# Altium project 1166V30.PrjPCB (part 1 of 2)
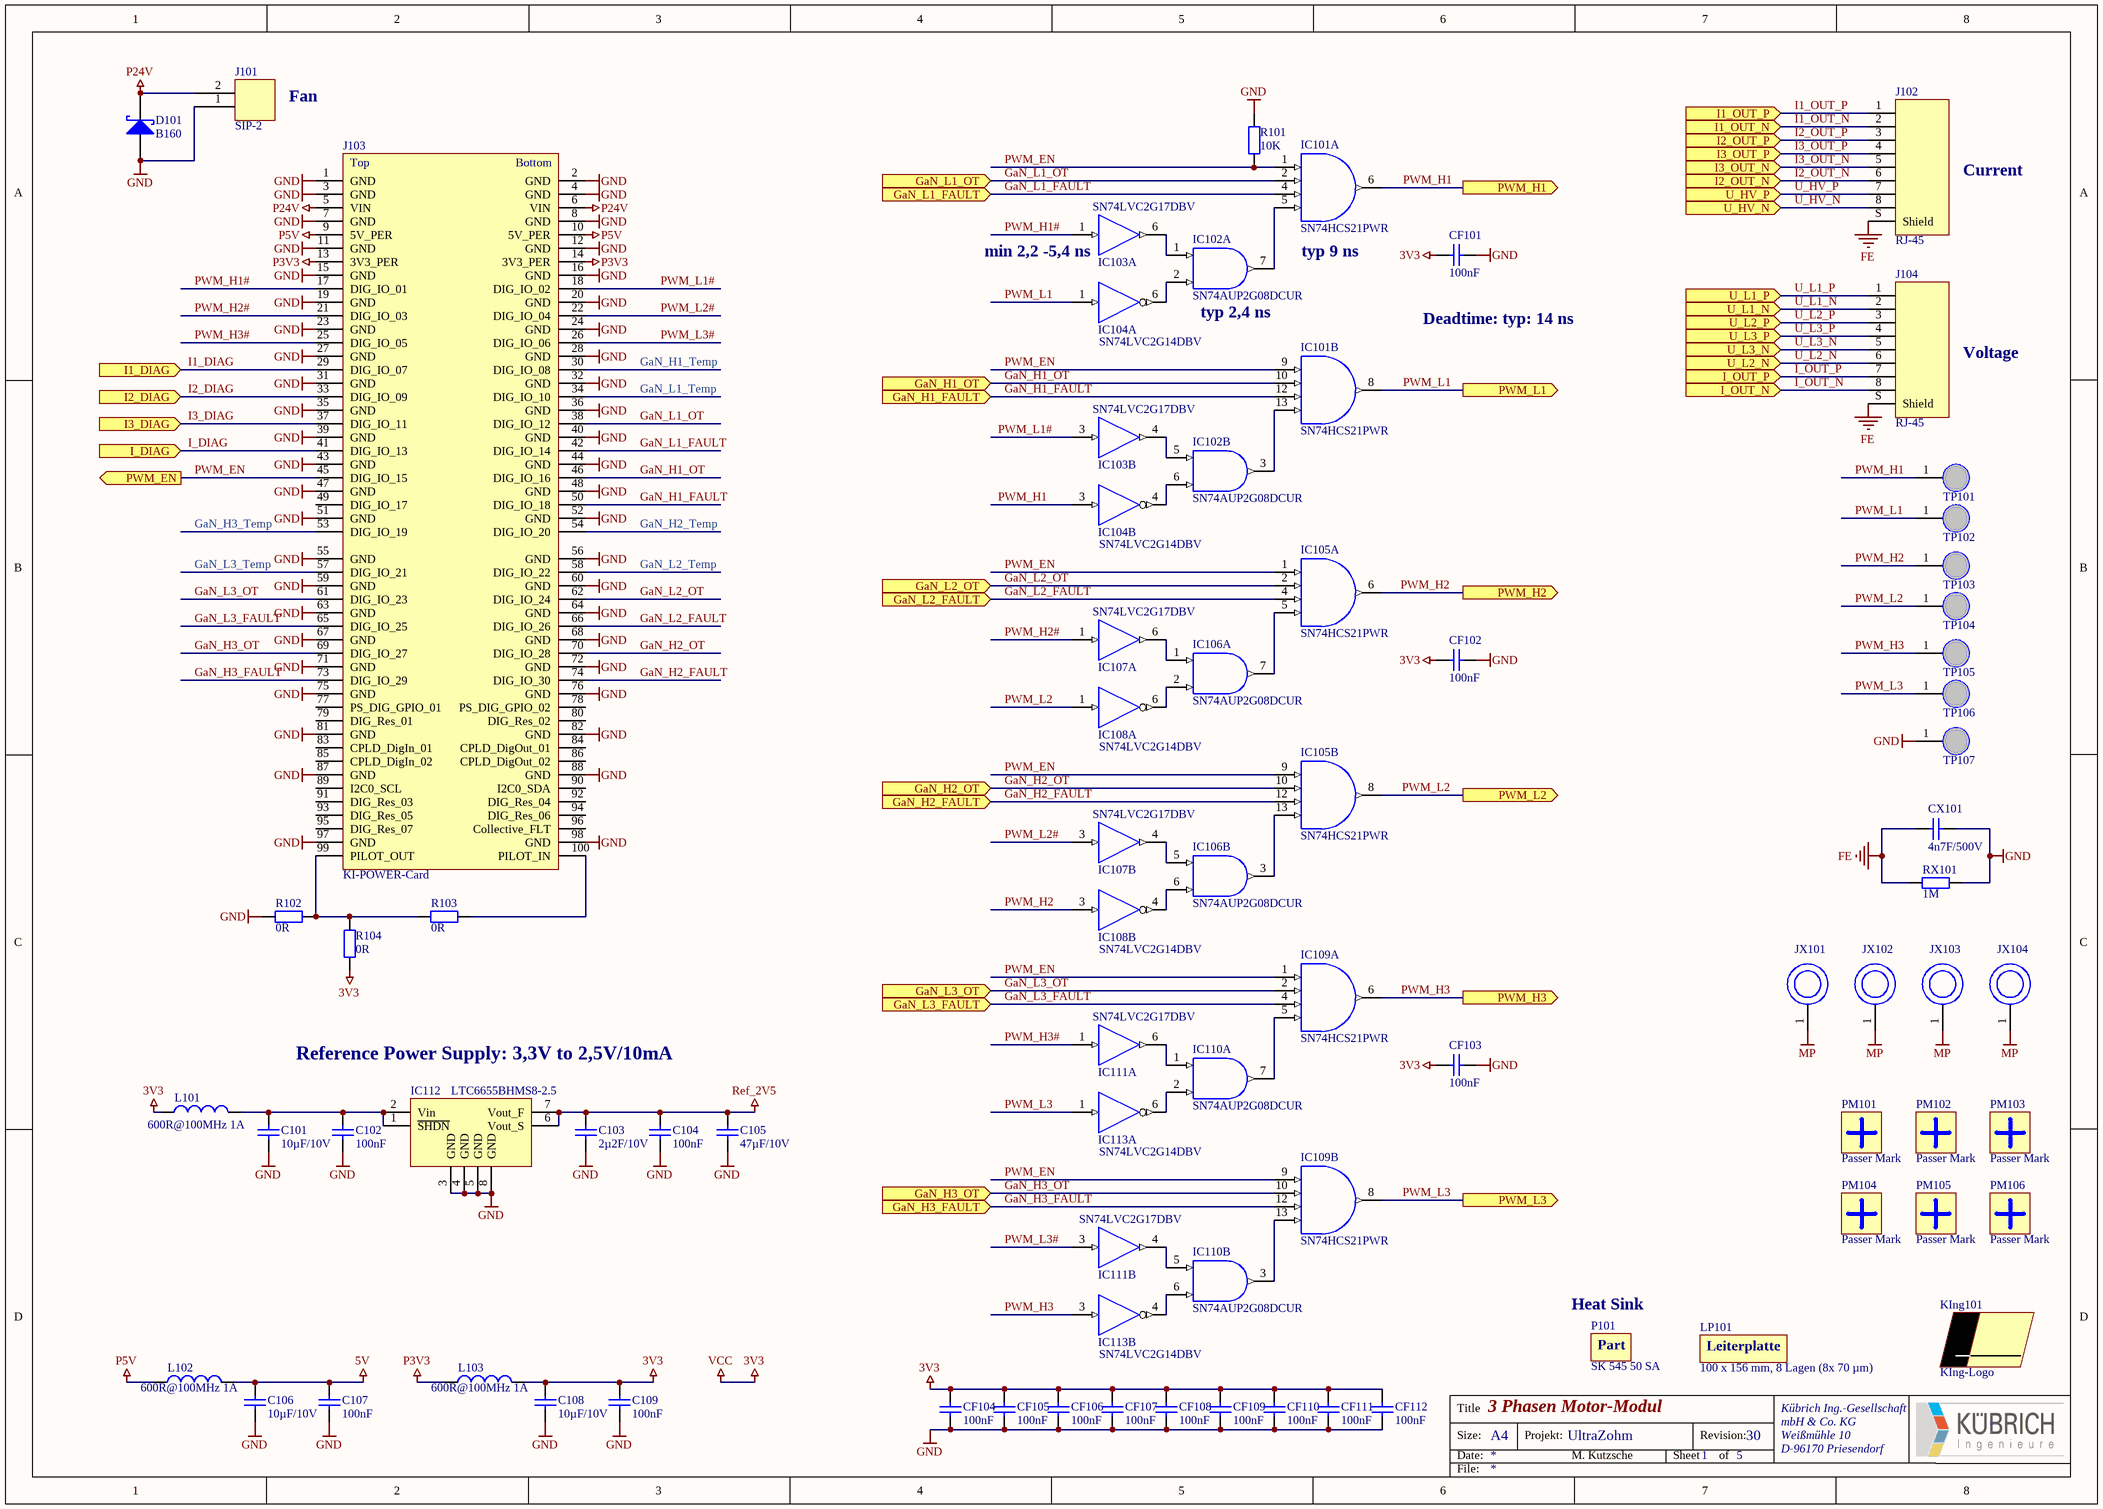
[diagram p0: 1166V30-1.SchDoc]
5 sheets, 581 parts. Net scope: flat (ports and power ports of the same name join across sheets).
Board file: 1166V30.PcbDoc
Sheets:
  1166V30-1.SchDoc
  1166V30-2.SchDoc
  1166V30-3.SchDoc
  1166V30-4.SchDoc
  1166V30-5.SchDoc

## Sheet 1166V30-1.SchDoc: 3 Phasen Motor-Modul
size A3; Author: M. Kutzsche; Organization: Kübrich Ing.-Gesellschaft; Address1: mbH & Co. KG; Address2: Weißmühle 10; Address3: D-96170 Priesendorf; DocumentNumber: UltraZohm; Revision: 30; SheetNumber: 1; SheetTotal: 5

### Parts
C101  10µF/10V  [0805-Cap]
C102  100nF  [0603-Cap]
C103  2µ2F/10V  [0805-Cap]
C104  100nF  [0603-Cap]
C105  47µF/10V  [1210-Cap]
C106  10µF/10V  [0603-Cap]
C107  100nF  [0603-Cap]
C108  10µF/10V  [0603-Cap]
C109  100nF  [0603-Cap]
CF101  100nF  [0603-Cap]
CF102  100nF  [0603-Cap]
CF103  100nF  [0603-Cap]
CF104  100nF  [0603-Cap]
CF105  100nF  [0603-Cap]
CF106  100nF  [0603-Cap]
CF107  100nF  [0603-Cap]
CF108  100nF  [0603-Cap]
CF109  100nF  [0603-Cap]
CF110  100nF  [0603-Cap]
CF111  100nF  [0603-Cap]
CF112  100nF  [0603-Cap]
CX101  4n7F/500V  [1206-Cap]
D101  B160  [SMA]
IC101  SN74HCS21PWR  [TSSOP-14]  (parts A,B of 2)
IC102  SN74AUP2G08DCUR  [VSSOP-8]  (parts A,B of 2)
IC103  SN74LVC2G17DBV  [SOT-23-6]  (parts A,B of 2)
IC104  SN74LVC2G14DBV  [SOT-23-6]  (parts A,B of 2)
IC105  SN74HCS21PWR  [TSSOP-14]  (parts A,B of 2)
IC106  SN74AUP2G08DCUR  [VSSOP-8]  (parts A,B of 2)
IC107  SN74LVC2G17DBV  [SOT-23-6]  (parts A,B of 2)
IC108  SN74LVC2G14DBV  [SOT-23-6]  (parts A,B of 2)
IC109  SN74HCS21PWR  [TSSOP-14]  (parts A,B of 2)
IC110  SN74AUP2G08DCUR  [VSSOP-8]  (parts A,B of 2)
IC111  SN74LVC2G17DBV  [SOT-23-6]  (parts A,B of 2)
IC112  LTC6655BHMS8-2.5  [MSOP-8 (RM-8)]
IC113  SN74LVC2G14DBV  [SOT-23-6]  (parts A,B of 2)
J101  SIP-2  [SIP-2]
J102  RJ-45  [WE-634008149821]
J103  KI-POWER-Card  [KI-POWER-CARD]
J104  RJ-45  [WE-634008149821]
JX101  Drill PAD  [PAD-6.0/3.2]  (value not drawn)  (no BOM)
JX102  Drill PAD  [PAD-6.0/3.2]  (value not drawn)  (no BOM)
JX103  Drill PAD  [PAD-6.0/3.2]  (value not drawn)  (no BOM)
JX104  Drill PAD  [PAD-6.0/3.2]  (value not drawn)  (no BOM)
KIng101  KIng-Logo  [King_Logo 900x300mil short]  (no BOM)
L101  600R@100MHz 1A  [0603-Ind]
L102  600R@100MHz 1A  [0603-Ind]
L103  600R@100MHz 1A  [0603-Ind]
LP101  100 x 156 mm, 8 Lagen (8x 70 µm)  [LP]
P101  SK 545 50 SA  [Part]
PM101  Passer Mark  [PASSER-MARK Rund 1,2mm]
PM102  Passer Mark  [PASSER-MARK Rund 1,2mm]
PM103  Passer Mark  [PASSER-MARK Rund 1,2mm]
PM104  Passer Mark  [PASSER-MARK Rund 1,2mm]
PM105  Passer Mark  [PASSER-MARK Rund 1,2mm]
PM106  Passer Mark  [PASSER-MARK Rund 1,2mm]
R101  10K  [0603-Res]
R102  0R  [0603-Res]
R103  0R  [0603-Res]
R104  0R  [0603-Res]
RX101  1M  [1206-Res]
TP101  Test-Point  [PAD-1.0/1.8]  (value not drawn)  (no BOM)
TP102  Test-Point  [PAD-1.0/1.8]  (value not drawn)  (no BOM)
TP103  Test-Point  [PAD-1.0/1.8]  (value not drawn)  (no BOM)
TP104  Test-Point  [PAD-1.0/1.8]  (value not drawn)  (no BOM)
TP105  Test-Point  [PAD-1.0/1.8]  (value not drawn)  (no BOM)
TP106  Test-Point  [PAD-1.0/1.8]  (value not drawn)  (no BOM)
TP107  Test-Point  [PAD-1.0/1.8]  (value not drawn)  (no BOM)

### Ports
GaN_H1_FAULT (in), GaN_H1_OT (in), GaN_H2_FAULT (in), GaN_H2_OT (in), GaN_H3_FAULT (in), GaN_H3_OT (in), GaN_L1_FAULT (in), GaN_L1_OT (in), GaN_L2_FAULT (in), GaN_L2_OT (in), GaN_L3_FAULT (in), GaN_L3_OT (in), I1_DIAG (in), I1_OUT_N (in), I1_OUT_P (in), I2_DIAG (in), I2_OUT_N (in), I2_OUT_P (in), I3_DIAG (in), I3_OUT_N (in), I3_OUT_P (in), I_DIAG (in), I_OUT_N (in), I_OUT_P (in), PWM_EN (out), PWM_H1 (out), PWM_H2 (out), PWM_H3 (out), PWM_L1 (out), PWM_L2 (out), PWM_L3 (out), U_HV_N (in), U_HV_P (in), U_L1_N (in), U_L1_P (in), U_L2_N (in), U_L2_P (in), U_L3_N (in), U_L3_P (in)

### Nets
3V3: C108.2 C109.2 CF101.2 CF102.2 CF103.2 CF104.1 CF105.1 CF106.1 CF107.1 CF108.1 CF109.1 CF110.1 CF111.1 CF112.1 IC101.14(VCC) IC102.8(VCC) IC103.5(VCC) IC104.5(VCC) IC105.14(VCC) IC106.8(VCC) IC107.5(VCC) IC108.5(VCC) IC109.14(VCC) IC110.8(VCC) IC111.5(VCC) IC113.5(VCC) L101.1 L103.2 R104.1  [also labelled VCC]
5V: C106.2 C107.2 L102.2
FE: CX101.1 J102.S(Shield) J104.S(Shield) RX101.1
GND: C101.1 C102.1 C103.1 C104.1 C105.1 C106.1 C107.1 C108.1 C109.1 CF101.1 CF102.1 CF103.1 CF104.2 CF105.2 CF106.2 CF107.2 CF108.2 CF109.2 CF110.2 CF111.2 CF112.2 CX101.2 D101.1(A) IC101.7(GND) IC102.4(GND) IC103.2(GND) IC104.2(GND) IC105.7(GND) IC106.4(GND) IC107.2(GND) IC108.2(GND) IC109.7(GND) IC110.4(GND) IC111.2(GND) IC112.3(GND) IC112.4(GND) IC112.5(GND) IC112.8(GND) IC113.2(GND) J101.1 J103.1(GND) J103.2(GND) J103.3(GND) J103.4(GND) J103.7(GND) J103.8(GND) J103.11(GND) J103.12(GND) J103.15(GND) J103.16(GND) J103.19(GND) J103.20(GND) J103.23(GND) J103.24(GND) J103.27(GND) J103.28(GND) J103.31(GND) J103.32(GND) J103.35(GND) J103.36(GND) J103.39(GND) J103.40(GND) J103.43(GND) J103.44(GND) J103.47(GND) J103.48(GND) J103.51(GND) J103.52(GND) J103.55(GND) J103.56(GND) J103.59(GND) J103.60(GND) J103.63(GND) J103.64(GND) J103.67(GND) J103.68(GND) J103.71(GND) J103.72(GND) J103.75(GND) J103.76(GND) J103.81(GND) J103.82(GND) J103.87(GND) J103.88(GND) J103.97(GND) J103.98(GND) R101.2 R102.1 RX101.2 TP107.1
MP: JX101.1 JX102.1 JX103.1 JX104.1
P3V3: J103.13(3V3_PER) J103.14(3V3_PER) L103.1
P5V: J103.9(5V_PER) J103.10(5V_PER) L102.1
P24V: D101.2(K) J101.2 J103.5(VIN) J103.6(VIN)
Ref_2V5: C103.2 C104.2 C105.2 IC112.6(Vout_S) IC112.7(Vout_F)
GaN_H1_FAULT: IC101.12(C2) J103.50(DIG_IO_18) ; port GaN_H1_FAULT
GaN_H1_OT: IC101.10(B2) J103.46(DIG_IO_16) ; port GaN_H1_OT
GaN_H1_Temp: J103.30(DIG_IO_08)
GaN_H2_FAULT: IC105.12(C2) J103.74(DIG_IO_30) ; port GaN_H2_FAULT
GaN_H2_OT: IC105.10(B2) J103.70(DIG_IO_28) ; port GaN_H2_OT
GaN_H2_Temp: J103.54(DIG_IO_20)
GaN_H3_FAULT: IC109.12(C2) J103.73(DIG_IO_29) ; port GaN_H3_FAULT
GaN_H3_OT: IC109.10(B2) J103.69(DIG_IO_27) ; port GaN_H3_OT
GaN_H3_Temp: J103.53(DIG_IO_19)
GaN_L1_FAULT: IC101.4(C1) J103.42(DIG_IO_14) ; port GaN_L1_FAULT
GaN_L1_OT: IC101.2(B1) J103.38(DIG_IO_12) ; port GaN_L1_OT
GaN_L1_Temp: J103.34(DIG_IO_10)
GaN_L2_FAULT: IC105.4(C1) J103.66(DIG_IO_26) ; port GaN_L2_FAULT
GaN_L2_OT: IC105.2(B1) J103.62(DIG_IO_24) ; port GaN_L2_OT
GaN_L2_Temp: J103.58(DIG_IO_22)
GaN_L3_FAULT: IC109.4(C1) J103.65(DIG_IO_25) ; port GaN_L3_FAULT
GaN_L3_OT: IC109.2(B1) J103.61(DIG_IO_23) ; port GaN_L3_OT
GaN_L3_Temp: J103.57(DIG_IO_21)
I1_DIAG: J103.29(DIG_IO_07) ; port I1_DIAG
I1_OUT_N: J102.2 ; port I1_OUT_N
I1_OUT_P: J102.1 ; port I1_OUT_P
I2_DIAG: J103.33(DIG_IO_09) ; port I2_DIAG
I2_OUT_N: J102.6 ; port I2_OUT_N
I2_OUT_P: J102.3 ; port I2_OUT_P
I3_DIAG: J103.37(DIG_IO_11) ; port I3_DIAG
I3_OUT_N: J102.5 ; port I3_OUT_N
I3_OUT_P: J102.4 ; port I3_OUT_P
I_DIAG: J103.41(DIG_IO_13) ; port I_DIAG
I_OUT_N: J104.8 ; port I_OUT_N
I_OUT_P: J104.7 ; port I_OUT_P
PWM_EN: IC101.1(A1) IC101.9(A2) IC105.1(A1) IC105.9(A2) IC109.1(A1) IC109.9(A2) J103.45(DIG_IO_15) R101.1 ; port PWM_EN
PWM_H1: IC101.6(O1) IC104.3(2A) TP101.1 ; port PWM_H1
PWM_H1#: IC103.1(1A) J103.17(DIG_IO_01)
PWM_H2: IC105.6(O1) IC108.3(2A) TP103.1 ; port PWM_H2
PWM_H2#: IC107.1(1A) J103.21(DIG_IO_03)
PWM_H3: IC109.6(O1) IC113.3(2A) TP105.1 ; port PWM_H3
PWM_H3#: IC111.1(1A) J103.25(DIG_IO_05)
PWM_L1: IC101.8(O2) IC104.1(1A) TP102.1 ; port PWM_L1
PWM_L1#: IC103.3(2A) J103.18(DIG_IO_02)
PWM_L2: IC105.8(O2) IC108.1(1A) TP104.1 ; port PWM_L2
PWM_L2#: IC107.3(2A) J103.22(DIG_IO_04)
PWM_L3: IC109.8(O2) IC113.1(1A) TP106.1 ; port PWM_L3
PWM_L3#: IC111.3(2A) J103.26(DIG_IO_06)
U_HV_N: J102.8 ; port U_HV_N
U_HV_P: J102.7 ; port U_HV_P
U_L1_N: J104.2 ; port U_L1_N
U_L1_P: J104.1 ; port U_L1_P
U_L2_N: J104.6 ; port U_L2_N
U_L2_P: J104.3 ; port U_L2_P
U_L3_N: J104.5 ; port U_L3_N
U_L3_P: J104.4 ; port U_L3_P
NetC101_2: C101.2 C102.2 IC112.1(~{SHDN}) IC112.2(Vin) L101.2
NetIC101_5: IC101.5(D1) IC102.7(1Y)
NetIC101_13: IC101.13(D2) IC102.3(2Y)
NetIC102_1: IC102.1(1A) IC103.6(1Y)
NetIC102_2: IC102.2(1B) IC104.6(1Y)
NetIC102_5: IC102.5(2A) IC103.4(2Y)
NetIC102_6: IC102.6(2B) IC104.4(2Y)
NetIC105_5: IC105.5(D1) IC106.7(1Y)
NetIC105_13: IC105.13(D2) IC106.3(2Y)
NetIC106_1: IC106.1(1A) IC107.6(1Y)
NetIC106_2: IC106.2(1B) IC108.6(1Y)
NetIC106_5: IC106.5(2A) IC107.4(2Y)
NetIC106_6: IC106.6(2B) IC108.4(2Y)
NetIC109_5: IC109.5(D1) IC110.7(1Y)
NetIC109_13: IC109.13(D2) IC110.3(2Y)
NetIC110_1: IC110.1(1A) IC111.6(1Y)
NetIC110_2: IC110.2(1B) IC113.6(1Y)
NetIC110_5: IC110.5(2A) IC111.4(2Y)
NetIC110_6: IC110.6(2B) IC113.4(2Y)
NetJ103_99: J103.99(PILOT_OUT) R102.2 R103.1 R104.2
NetJ103_100: J103.100(PILOT_IN) R103.2

Not connected (* = marked no-connect by the designer): J103 49(DIG_IO_17) 77(PS_DIG_GPIO_01) 78(PS_DIG_GPIO_02) 79(DIG_Res_01) 80(DIG_Res_02) 83(CPLD_DigIn_01) 84(CPLD_DigOut_01) 85(CPLD_DigIn_02) 86(CPLD_DigOut_02) 89(I2C0_SCL) 90(I2C0_SDA) 91(DIG_Res_03) 92(DIG_Res_04) 93(DIG_Res_05) 94(DIG_Res_06) 95(DIG_Res_07) 96(Collective_FLT)

### Notes on the sheet
- Fan
- Current
- (near IC103) min 2,2 -5,4 ns
- (near IC102) typ 2,4 ns
- typ 9 ns
- Deadtime: typ: 14 ns
- Voltage
- Reference Power Supply: 3,3V to 2,5V/10mA
- Heat Sink
- Title
- Size:
- Date:
- A4
- Projekt:
- Sheet
- Revision:
- of
- File:
- (in symbol KI-POWER-Card) Top; Bottom

### Library data of the parts
C101-C109 CF101-CF112 CX101 = Cap_SMD: Capacitor (SMD); Class I: Pasiv; Class II: Capacitor; Last edited: 20.11.2006 10:25
  C101 C106 C108: value: 10µF/10V
  C102 C104 C107 C109 CF101-CF112: value: 100nF
  C103: value: 2µ2F/10V
  C105: value: 47µF/10V
  CX101: value: 4n7F/500V
D101 = B160: Schottky Barrier Rectifier Vr=60V If=1A; Manufacturer: General Semiconductor; Class II: Schottky Earrier Rectifier Vr=60V If=1A; Class I: Discret; Package information: Unknown; Best.-Nr.: Farnell 145-6528RL; Datasheet: Ver. 7 Nov 2000; Package reference: DO-214AC (SMA)
IC101 IC105 IC109 = SN74HCS21PWR: Dual 4-Input AND Gate with Schmitt Trigger Input; Manufacturer: Texas Instrument; Package Information: Unknown; Class I: Logic; Best.-Nr.: DigiKey: 296-SN74HCS21PWRCT-ND; Datasheet: SCES200J; Package Reference: TSSOP-14; Class II: Gate
IC102 IC106 IC110 = SN74AUP2G08DCUR: (VSSOP) Dual 2-Input Positive AND Gate; Manufacturer: Texas Instrument; Package Information: Unknown; Class I: Logic; Datasheet: SCES193J, Rev. Sep 2003; Package Reference: VSSOP-8; Class II: Dual 2-Input Positive AND Gate
IC103 IC107 IC111 = SN74LVC2G17D_: Dual Buffer with Schmitt Trigger Input; Manufacturer: Texas Instrument; Class I: Logic; value121: SN74LVC2G17DCK; Best.-Nr.: Farnell 147-0776 (SOT23-6), 128-7569 (SC-70); Datasheet: SCES381E, Rev. Sep 2003; Class II: Dual Buffer with Schmitt Trigger Input; value111: SN74LVC2G17DBV; Last edited: 22.01.2007 11:08
IC104 IC108 IC113 = SN74LVC2G14D_: Dual Inverter with Schmitt Trigger Input; Manufacturer: Texas Instrument; Class I: Logic; value121: SN74LVC2G14DCK; Datasheet: SCES200J; Class II: Dual Inverter with Schmitt Trigger Input; value111: SN74LVC2G14DBV; Last edited: 22.01.2007 11:08
IC112 = LTC6655BHMS8-2.5: Voltage References 2,5V, 2ppm/°C, Low Noise 0,25ppm; Manufacturer: Linear Technology; Class I: Discret; Package information: Unknown; Best.-Nr.: Farnell 229-5508; Class II: Voltage References 2,5V, 2ppm/°C, Low Noise 0,25ppm; Datasheet: Unknown; Package reference: MSOP-8
J101 = SIP-2: Single In-line Connector 2 pin; Class I: Connectors; Class II: Single In-line Connector 2 pin; Last edited: 08.12.2006 17:09
J102 J104 = WE-634008149821: SMD CAT3 RJ-45 Connector; Manufacturer: Würth Elektronik; Class I: Connectors; Class II: RJ-45 Connector; Package reference: WE-634008149821; Datasheet: Unknown; Best.-Nr.: WE-634008149821
J103 = KI-POWER-Card: Einsteckkarte für KI-POWER Projekt (Ultra ZYNQ); Manufacturer: Samtec; Class I: Connectors; Best.-Nr.: Gegenstecker: Samtec HSEC8-150-01-XX-DV-A-BL; Class II: Einsteckkarte für KI-POWER Projekt (Ultra ZYNQ); Datasheet: 2000/1; Last edited: 07.09.2020 13:28
JX101-JX104 = Drill PAD: PAD
KIng101 = KIng-Logo: Kuebrich-Ing. Logo
L101-L103 = WE-742792651: Ferrite SMD 600R@100MHz 1A (0603); Manufacturer: Wuerth-Elektronik; Class I: Pasive; Class II: Ferrite SMD 600R@100MHz 1A; Last edited: 08.12.2006 12:28; Best.-Nr.: WE-742792651
LP101 = Leiterplatte: Leiterplatte 100 x 156 mm, 8 Lagen (8x 70 µm); Manufacturer: Generic Manufacturer; Footprint: Größe 100 x 156 mm
P101 = Part: Kühlkörper 80x50x10 mm; Manufacturer: Fischer Elektronik; Best.-Nr.: SK 545 50 SA
R101-R104 RX101 = Res_SMD: Resistor SMD; Class I: Pasiv; Class II: Resistor; Last edited: 17.11.2006 11:38
  R101: value: 10K
  R102-R104: value: 0R
  RX101: value: 1M
TP101-TP107 = Test-Point: PAD

## Sheet 1166V30-2.SchDoc: Half-Bridge Phase 1
size A3; Author: M. Kutzsche; Organization: Kübrich Ing.-Gesellschaft; Address1: mbH & Co. KG; Address2: Weißmühle 10; Address3: D-96170 Priesendorf; DocumentNumber: UltraZohm; Revision: 30; SheetNumber: 2; SheetTotal: 5
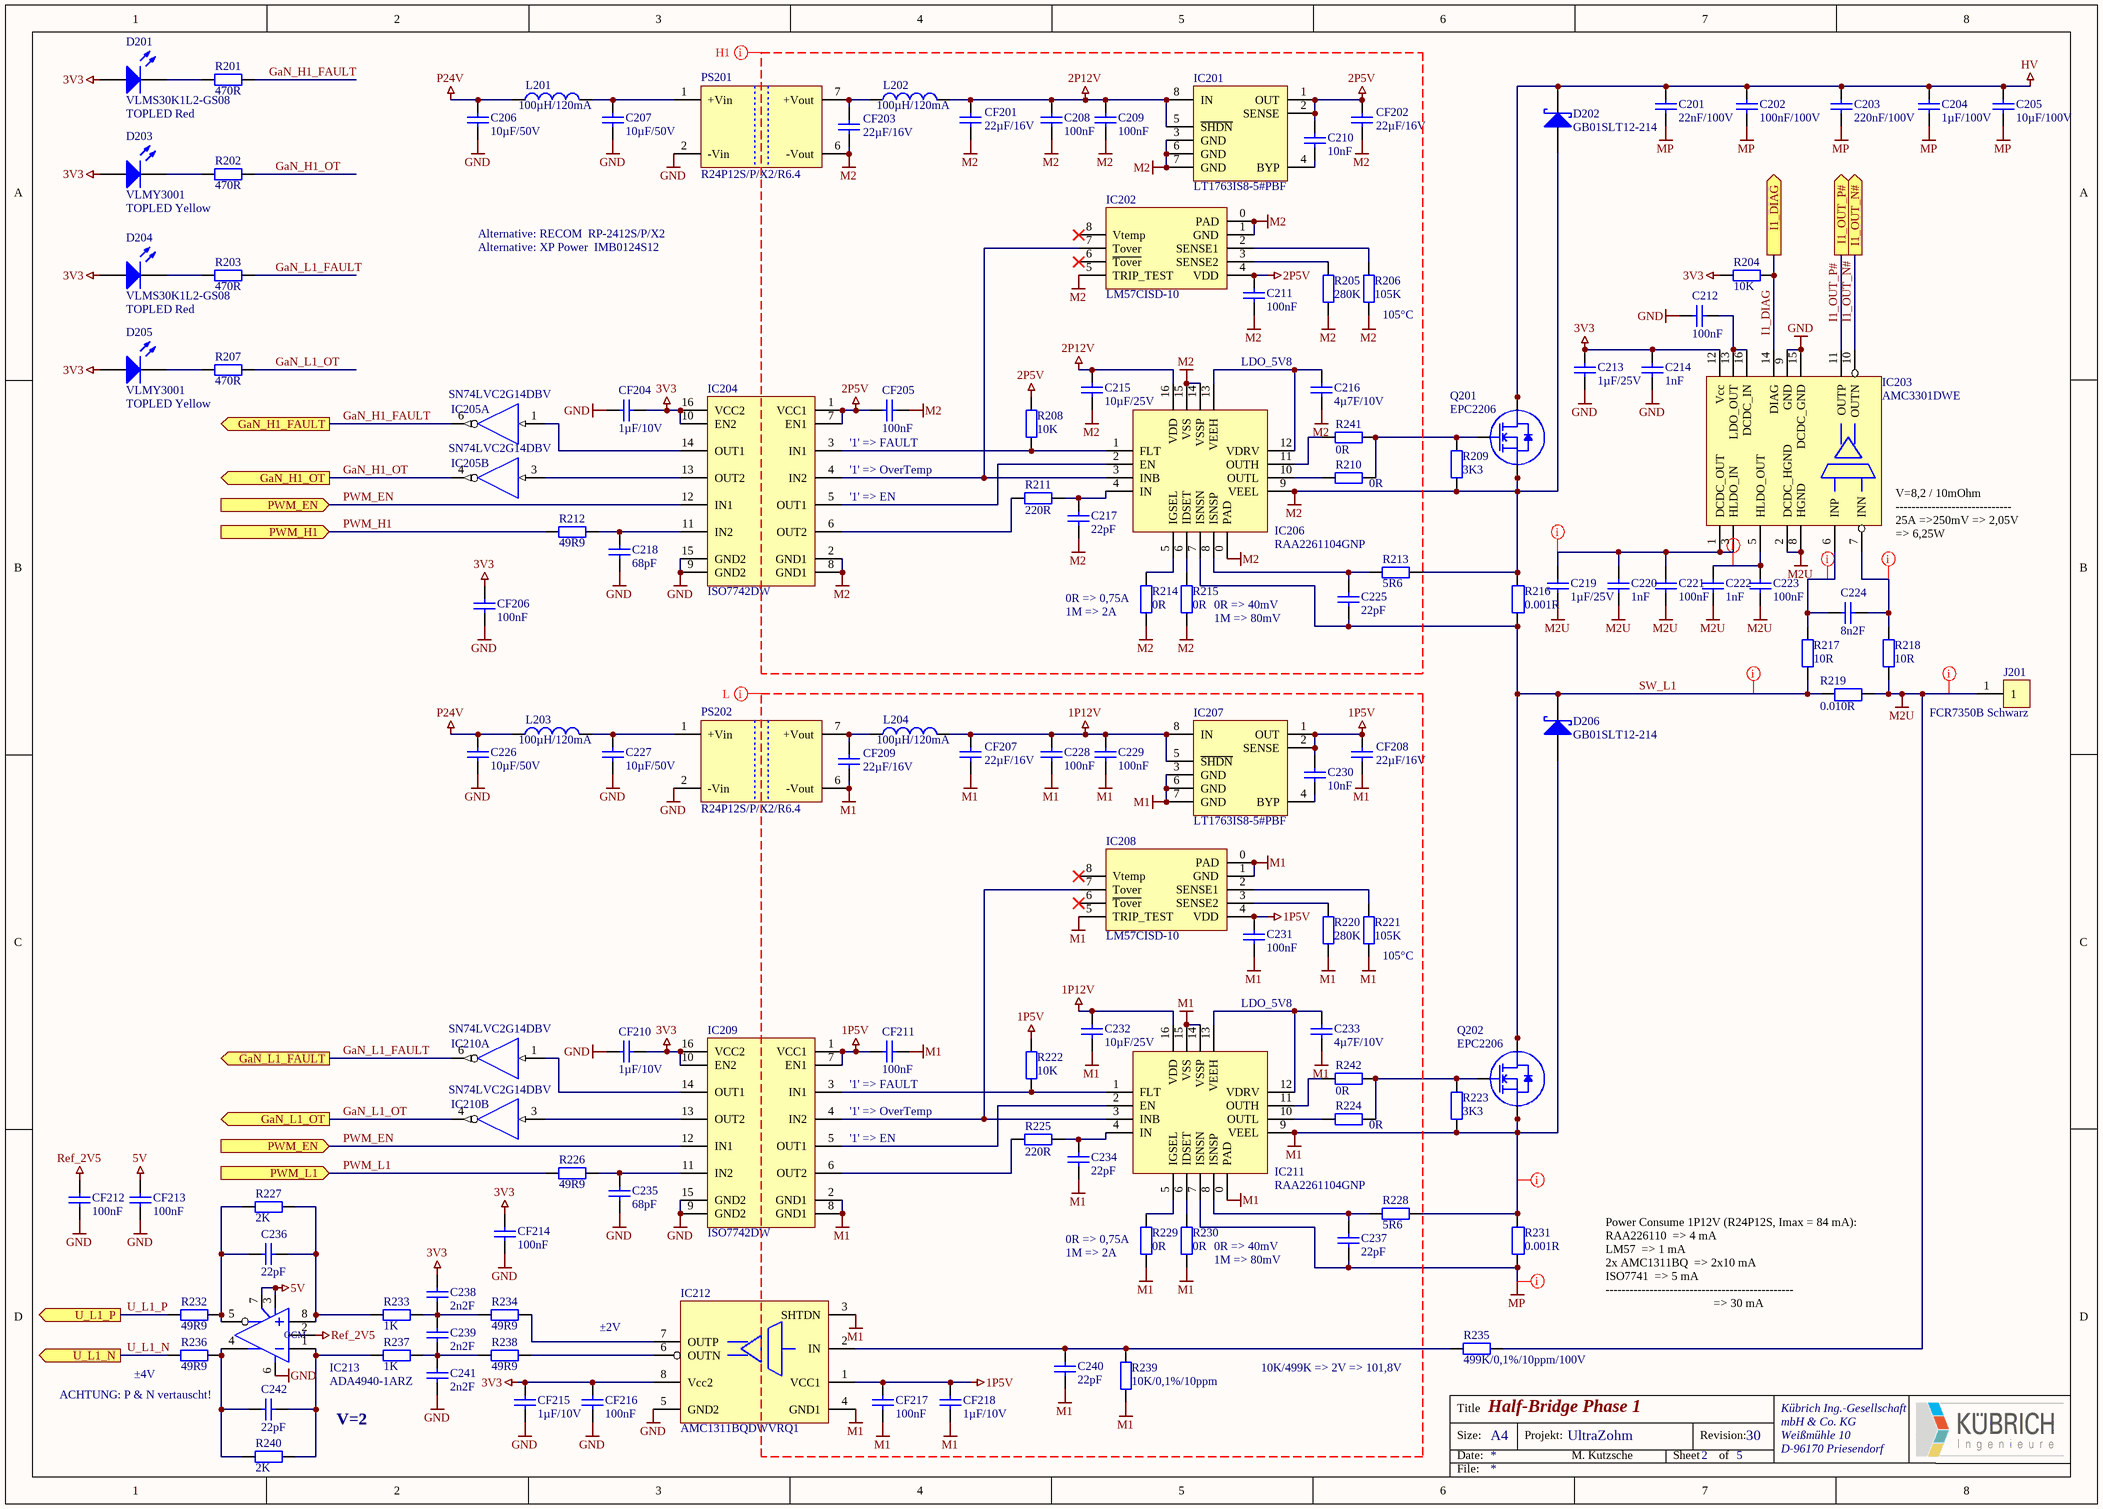
[diagram p1: 1166V30-2.SchDoc]

### Parts
C201  22nF/100V  [0805-Cap]
C202  100nF/100V  [0805-Cap]
C203  220nF/100V  [0805-Cap]
C204  1µF/100V  [0805-Cap]
C205  10µF/100V  [1210-Cap]
C206  10µF/50V  [1206-Cap]
C207  10µF/50V  [1206-Cap]
C208  100nF  [0603-Cap]
C209  100nF  [0603-Cap]
C210  10nF  [0603-Cap]
C211  100nF  [0603-Cap]
C212  100nF  [0603-Cap]
C213  1µF/25V  [1206-Cap]
C214  1nF  [1206-Cap]
C215  10µF/25V  [0805-Cap]
C216  4µ7F/10V  [0805-Cap]
C217  22pF  [0603-Cap]
C218  68pF  [0603-Cap]
C219  1µF/25V  [0603-Cap]
C220  1nF  [0603-Cap]
C221  100nF  [0603-Cap]
C222  1nF  [1206-Cap]
C223  100nF  [1206-Cap]
C224  8n2F  [0603-Cap]
C225  22pF  [0603-Cap]
C226  10µF/50V  [1206-Cap]
C227  10µF/50V  [1206-Cap]
C228  100nF  [0603-Cap]
C229  100nF  [0603-Cap]
C230  10nF  [0603-Cap]
C231  100nF  [0603-Cap]
C232  10µF/25V  [0805-Cap]
C233  4µ7F/10V  [0805-Cap]
C234  22pF  [0603-Cap]
C235  68pF  [0603-Cap]
C236  22pF  [0603-Cap]
C237  22pF  [0603-Cap]
C238  2n2F  [0603-Cap]
C239  2n2F  [0603-Cap]
C240  22pF  [0603-Cap]
C241  2n2F  [0603-Cap]
C242  22pF  [0603-Cap]
CF201  22µF/16V  [0805-Cap]
CF202  22µF/16V  [0805-Cap]
CF203  22µF/16V  [0805-Cap]
CF204  1µF/10V  [0603-Cap]
CF205  100nF  [0603-Cap]
CF206  100nF  [0603-Cap]
CF207  22µF/16V  [0805-Cap]
CF208  22µF/16V  [0805-Cap]
CF209  22µF/16V  [0805-Cap]
CF210  1µF/10V  [0603-Cap]
CF211  100nF  [0603-Cap]
CF212  100nF  [0603-Cap]
CF213  100nF  [0603-Cap]
CF214  100nF  [0603-Cap]
CF215  1µF/10V  [0603-Cap]
CF216  100nF  [0603-Cap]
CF217  100nF  [0603-Cap]
CF218  1µF/10V  [0603-Cap]
D201  VLMS30K1L2-GS08  Class II: TOPLED Red  [PLCC-2_rot]
D202  GB01SLT12-214  [DO-214 (SMB)]
D203  VLMY3001  Class II: TOPLED Yellow  [PLCC-2_gelb]
D204  VLMS30K1L2-GS08  Class II: TOPLED Red  [PLCC-2_rot]
D205  VLMY3001  Class II: TOPLED Yellow  [PLCC-2_gelb]
D206  GB01SLT12-214  [DO-214 (SMB)]
IC201  LT1763IS8-5#PBF  [SOIC-8-N]
IC202  LM57CISD-10  [WSON-8 (2.5x2.5mm)]
IC203  AMC3301DWE  [SOIC-16-W - 8.1mm]
IC204  ISO7742DW  [SOIC-16-W - 8.1mm]
IC205  SN74LVC2G14DBV  [SOT-23-6]  (parts A,B of 2)
IC206  RAA2261104GNP  [QFN-16 (4x4mm)]
IC207  LT1763IS8-5#PBF  [SOIC-8-N]
IC208  LM57CISD-10  [WSON-8 (2.5x2.5mm)]
IC209  ISO7742DW  [SOIC-16-W - 8.1mm]
IC210  SN74LVC2G14DBV  [SOT-23-6]  (parts A,B of 2)
IC211  RAA2261104GNP  [QFN-16 (4x4mm)]
IC212  AMC1311BQDWVRQ1  [SOIC-8-W]
IC213  ADA4940-1ARZ  [SOIC-8-N]
J201  FCR7350B Schwarz  [SLB4-I/90 - 4mm - Schwarz - CLIFF]
L201  100µH/120mA  [1007-IND (2518)]
L202  100µH/120mA  [1007-IND (2518)]
L203  100µH/120mA  [1007-IND (2518)]
L204  100µH/120mA  [1007-IND (2518)]
PS201  R24P12S/P/X2/R6.4  [SIP-7 Single - X2]
PS202  R24P12S/P/X2/R6.4  [SIP-7 Single - X2]
Q201  EPC2206  [D0232]
Q202  EPC2206  [D0232]
R201  470R  [0603-Res]
R202  470R  [0603-Res]
R203  470R  [0603-Res]
R204  10K  [0603-Res]
R205  280K  [0603-Res]
R206  105K  [0603-Res]
R207  470R  [0603-Res]
R208  10K  [0603-Res]
R209  3K3  [0603-Res]
R210  0R  [0603-Res]
R211  220R  [0603-Res]
R212  49R9  [0603-Res]
R213  5R6  [0603-Res]
R214  0R  [0603-Res]
R215  0R  [0603-Res]
R216  0.001R  [2512]
R217  10R  [0603-Res]
R218  10R  [0603-Res]
R219  0.010R  [GMR320]
R220  280K  [0603-Res]
R221  105K  [0603-Res]
R222  10K  [0603-Res]
R223  3K3  [0603-Res]
R224  0R  [0603-Res]
R225  220R  [0603-Res]
R226  49R9  [0603-Res]
R227  2K  [0603-Res]
R228  5R6  [0603-Res]
R229  0R  [0603-Res]
R230  0R  [0603-Res]
R231  0.001R  [2512]
R232  49R9  [0603-Res]
R233  1K  [0603-Res]
R234  49R9  [0603-Res]
R235  499K/0,1%/10ppm/100V  [0805-Res]
R236  49R9  [0603-Res]
R237  1K  [0603-Res]
R238  49R9  [0603-Res]
R239  10K/0,1%/10ppm  [0603-Res]
R240  2K  [0603-Res]
R241  0R  [0603-Res]
R242  0R  [0603-Res]

### Ports
GaN_H1_FAULT (out), GaN_H1_OT (out), GaN_L1_FAULT (out), GaN_L1_OT (out), I1_DIAG (out), I1_OUT_N# (out), I1_OUT_P# (out), PWM_EN (in), PWM_H1 (in), PWM_L1 (in), U_L1_N (out), U_L1_P (out)

### Nets
1P5V: C230.1 C231.1 CF208.1 CF211.2 CF217.1 CF218.1 IC207.1(OUT) IC207.2(SENSE) IC208.4(VDD) IC209.1(VCC1) IC209.7(EN1) IC212.1(VCC1) R222.1
1P12V: C228.1 C229.1 C232.2 CF207.1 IC207.5(~{SHDN}) IC207.8(IN) IC211.16(VDD) L204.2
2P5V: C210.1 C211.1 CF202.1 CF205.2 IC201.1(OUT) IC201.2(SENSE) IC202.4(VDD) IC204.1(VCC1) IC204.7(EN1) R208.1
2P12V: C208.1 C209.1 C215.2 CF201.1 IC201.5(~{SHDN}) IC201.8(IN) IC206.16(VDD) L202.2
3V3: C213.1 C214.1 C238.2 CF204.1 CF206.1 CF210.1 CF214.1 CF215.1 CF216.1 D201.1(A) D203.1(A) D204.1(A) D205.1(A) IC203.12(Vcc) IC204.10(EN2) IC204.16(VCC2) IC205.5(VCC) IC209.10(EN2) IC209.16(VCC2) IC210.5(VCC) IC212.8(Vcc2) R204.2  [also labelled VCC]
5V: CF213.1 IC213.3(V+) IC213.7(EN)
GND: C206.1 C207.1 C212.1 C213.2 C214.2 C218.1 C226.1 C227.1 C235.1 C241.1 CF204.2 CF206.2 CF210.2 CF212.2 CF213.2 CF214.2 CF215.2 CF216.2 IC203.9(GND) IC203.15(DCDC_GND) IC204.9(GND2) IC204.15(GND2) IC205.2(GND) IC209.9(GND2) IC209.15(GND2) IC210.2(GND) IC212.5(GND2) IC213.6(V-) PS201.2(-Vin) PS202.2(-Vin)
HV: C201.1 C202.1 C203.1 C204.1 C205.1 D202.2(K) Q201.3(D1) Q201.4(D2) Q201.7(D3) Q201.8(D4) Q201.11(D5) Q201.12(D6) Q201.15(D7) Q201.16(D8) Q201.19(D9) Q201.20(D10) Q201.23(D11) Q201.24(D12) Q201.27(D13) Q201.28(D14)
M1: C228.2 C229.2 C231.2 C232.1 C233.2 C234.1 C240.1 CF207.2 CF208.2 CF209.2 CF211.1 CF217.2 CF218.2 D206.1(A) IC207.3(GND) IC207.6(GND) IC207.7(GND) IC208.0(PAD) IC208.1(GND) IC208.5(TRIP_TEST) IC209.2(GND1) IC209.8(GND1) IC211.0(PAD) IC211.9(VEEL) IC211.14(VSSP) IC211.15(VSS) IC212.3(SHTDN) IC212.4(GND1) PS202.6(-Vout) Q202.2(S1) Q202.5(S2) Q202.6(S3) Q202.9(S4) Q202.10(S5) Q202.13(S6) Q202.14(S7) Q202.17(S8) Q202.18(S9) Q202.21(S10) Q202.22(S11) Q202.25(S12) Q202.26(S13) Q202.29(S14) Q202.30(Sub) R220.2 R221.2 R223.1 R228.2 R229.2 R230.2 R231.2 R239.2
M2: C208.2 C209.2 C211.2 C215.1 C216.2 C217.1 CF201.2 CF202.2 CF203.2 CF205.1 D202.1(A) IC201.3(GND) IC201.6(GND) IC201.7(GND) IC202.0(PAD) IC202.1(GND) IC202.5(TRIP_TEST) IC204.2(GND1) IC204.8(GND1) IC206.0(PAD) IC206.9(VEEL) IC206.14(VSSP) IC206.15(VSS) PS201.6(-Vout) Q201.2(S1) Q201.5(S2) Q201.6(S3) Q201.9(S4) Q201.10(S5) Q201.13(S6) Q201.14(S7) Q201.17(S8) Q201.18(S9) Q201.21(S10) Q201.22(S11) Q201.25(S12) Q201.26(S13) Q201.29(S14) Q201.30(Sub) R205.2 R206.2 R209.1 R213.2 R214.2 R215.2 R216.2
M2U: C219.2 C220.2 C221.2 C222.2 C223.2 IC203.2(DCDC_HGND) IC203.8(HGND) J201.1 R218.1 R219.1 R235.2
MP: C201.2 C202.2 C203.2 C204.2 C205.2 C237.1 IC211.7(ISNSN) R231.1
P24V: C206.2 C226.2 L201.1 L203.1
Ref_2V5: CF212.1 IC213.2(OCM)
GaN_H1_FAULT: IC205.6(1Y) R201.2 ; port GaN_H1_FAULT
GaN_H1_OT: IC205.4(2Y) R202.2 ; port GaN_H1_OT
GaN_L1_FAULT: IC210.6(1Y) R203.2 ; port GaN_L1_FAULT
GaN_L1_OT: IC210.4(2Y) R207.2 ; port GaN_L1_OT
I1_DIAG: IC203.14(DIAG) R204.1 ; port I1_DIAG
I1_OUT_N#: IC203.10(OUTN) ; port I1_OUT_N#
I1_OUT_P#: IC203.11(OUTP) ; port I1_OUT_P#
PWM_EN: IC204.12(IN1) IC209.12(IN1) ; port PWM_EN
PWM_H1: R212.2 ; port PWM_H1
PWM_L1: R226.2 ; port PWM_L1
SW_L1: C225.1 D206.2(K) IC206.7(ISNSN) Q202.3(D1) Q202.4(D2) Q202.7(D3) Q202.8(D4) Q202.11(D5) Q202.12(D6) Q202.15(D7) Q202.16(D8) Q202.19(D9) Q202.20(D10) Q202.23(D11) Q202.24(D12) Q202.27(D13) Q202.28(D14) R216.1 R217.1 R219.2
U_L1_N: R236.2 ; port U_L1_N
U_L1_P: R232.2 ; port U_L1_P
NetC207_2: C207.2 L201.2 PS201.1(+Vin)
NetC210_2: C210.2 IC201.4(BYP)
NetC212_2: C212.2 IC203.13(LDO_OUT) IC203.16(DCDC_IN)
NetC216_1: C216.1 IC206.12(VDRV) IC206.13(VEEH)
NetC217_2: C217.2 IC206.4(IN) R211.1
NetC218_2: C218.2 IC204.11(IN2) R212.1
NetC219_1: C219.1 C220.1 C221.1 IC203.1(DCDC_OUT) IC203.3(HLDO_IN)
NetC222_1: C222.1 C223.1 IC203.5(HLDO_OUT)
NetC224_1: C224.1 IC203.7(INN) R218.2
NetC224_2: C224.2 IC203.6(INP) R217.2
NetC225_2: C225.2 IC206.8(ISNSP) R213.1
NetC227_2: C227.2 L203.2 PS202.1(+Vin)
NetC230_2: C230.2 IC207.4(BYP)
NetC233_1: C233.1 IC211.12(VDRV) IC211.13(VEEH)
NetC234_2: C234.2 IC211.4(IN) R225.1
NetC235_2: C235.2 IC209.11(IN2) R226.1
NetC236_1: C236.1 IC213.8(+) R227.1 R233.2
NetC236_2: C236.2 IC213.5(Out) R227.2 R232.1
NetC237_2: C237.2 IC211.8(ISNSP) R228.1
NetC238_1: C238.1 C239.2 R233.1 R234.2
NetC239_1: C239.1 C241.2 R237.1 R238.2
NetC240_2: C240.2 IC212.2(IN) R235.1 R239.1
NetC242_1: C242.1 IC213.1(-) R237.2 R240.1
NetC242_2: C242.2 IC213.4(Out) R236.1 R240.2
NetCF203_1: CF203.1 L202.1 PS201.7(+Vout)
NetCF209_1: CF209.1 L204.1 PS202.7(+Vout)
NetD201_2: D201.2(K) R201.1
NetD203_2: D203.2(K) R202.1
NetD204_2: D204.2(K) R203.1
NetD205_2: D205.2(K) R207.1
NetIC202_2: IC202.2(SENSE1) R206.1
NetIC202_3: IC202.3(SENSE2) R205.1
NetIC202_7: IC202.7(Tover) IC204.4(IN2) IC206.3(INB)
NetIC204_3: IC204.3(IN1) IC206.1(FLT) R208.2
NetIC204_5: IC204.5(OUT1) IC206.2(EN)
NetIC204_6: IC204.6(OUT2) R211.2
NetIC204_13: IC204.13(OUT2) IC205.3(2A)
NetIC204_14: IC204.14(OUT1) IC205.1(1A)
NetIC206_5: IC206.5(IGSEL) R214.1
NetIC206_6: IC206.6(IDSET) R215.1
NetIC206_10: IC206.10(OUTL) R210.1
NetIC206_11: IC206.11(OUTH) R241.1
NetIC208_2: IC208.2(SENSE1) R221.1
NetIC208_3: IC208.3(SENSE2) R220.1
NetIC208_7: IC208.7(Tover) IC209.4(IN2) IC211.3(INB)
NetIC209_3: IC209.3(IN1) IC211.1(FLT) R222.2
NetIC209_5: IC209.5(OUT1) IC211.2(EN)
NetIC209_6: IC209.6(OUT2) R225.2
NetIC209_13: IC209.13(OUT2) IC210.3(2A)
NetIC209_14: IC209.14(OUT1) IC210.1(1A)
NetIC211_5: IC211.5(IGSEL) R229.1
NetIC211_6: IC211.6(IDSET) R230.1
NetIC211_10: IC211.10(OUTL) R224.1
NetIC211_11: IC211.11(OUTH) R242.1
NetIC212_6: IC212.6(OUTN) R238.1
NetIC212_7: IC212.7(OUTP) R234.1
NetQ201_1: Q201.1(G) R209.2 R210.2 R241.2
NetQ202_1: Q202.1(G) R223.2 R224.2 R242.2

Not connected (* = marked no-connect by the designer): IC202 6(~{Tover})* 8(Vtemp)*; IC208 6(~{Tover})* 8(Vtemp)*

### Layout directives
net class H1: 2P5V, 2P12V, M2, M2U, NetC219_1, NetC222_1, NetC224_1, NetC224_2, SW_L1
net class L: 1P5V, 1P12V, M1, MP

### Notes on the sheet
- Alternative: RECOM  RP-2412S/P/X2
- Alternative: XP Power  IMB0124S12
- (near R206) 105°C
- LDO_5V8
- '1' => FAULT
- '1' => OverTemp
- (near IC204) '1' => EN
- (near IC203) V=8,2 / 10mOhm
  -----------------------------
  25A =>250mV => 2,05V
  => 6,25W
- (near R214) 1M => 2A
- (near R214) 0R => 0,75A
- (near R215) 0R => 40mV
- (near R215) 1M => 80mV
- (near R221) 105°C
- (near IC209) '1' => EN
- (near R229) 1M => 2A
- (near R229) 0R => 0,75A
- (near R230) 0R => 40mV
- (near R230) 1M => 80mV
- Power Consume 1P12V (R24P12S, Imax = 84 mA):
  RAA226110 	=> 4 mA
  LM57		=> 1 mA
  2x AMC1311BQ 	=> 2x10 mA
  ISO7741		=> 5 mA
  -----------------------------------------------
  => 30 mA
- ACHTUNG: P & N vertauscht!
- (near R236) ±4V
- ±2V
- 10K/499K => 2V => 101,8V
- V=2
- Title
- Size:
- Date:
- A4
- Projekt:
- Sheet
- Revision:
- of
- File:

### Library data of the parts
C201-C242 CF201-CF218 = Cap_SMD: Capacitor (SMD); Class I: Pasiv; Class II: Capacitor; Last edited: 20.11.2006 10:25
  C201: value: 22nF/100V
  C202: value: 100nF/100V
  C203: value: 220nF/100V
  C204: value: 1µF/100V
  C205: value: 10µF/100V
  C206 C207 C226 C227: value: 10µF/50V
  C208 C209 C211 C212 C221 C223 C228 C229 C231 CF205 CF206 CF211-CF214 CF216 CF217: value: 100nF
  C210 C230: value: 10nF
  C213 C219: value: 1µF/25V
  C214 C220 C222: value: 1nF
  C215 C232: value: 10µF/25V
  C216 C233: value: 4µ7F/10V
  C217 C225 C234 C236 C237 C240 C242: value: 22pF
  C218 C235: value: 68pF
  C224: value: 8n2F
  C238 C239 C241: value: 2n2F
  CF201-CF203 CF207-CF209: value: 22µF/16V
  CF204 CF210 CF215 CF218: value: 1µF/10V
D201 D204 = VLMS30K1L2-GS08: Top LED Super red, 2mA, 18mcd, -40-100°C; Manufacturer: Vishay; Class I: Discrete; Best.-Nr.: Farnell 132-8349; Last edited: 23.01.2007 08:58
D202 D206 = GB01SLT12-214: Silicon Carbide Schottky Diode Vr=1200V If=1A; Manufacturer: GeneSiC Semiconductor; Class I: Discret; Package information: Unknown; Best.-Nr.: DigiKey: 1242-1169-1-ND; Class II: Silicon Carbide Schottky Diode Vr=1200V If=1A; Datasheet: Ver. 7 Nov 2000; Package reference: DO-214AA (SMB)
D203 D205 = VLMY3001: Top LED Yellow, 2mA, 18mcd, -40-100°C; Manufacturer: Vishay; Class I: Discrete; Best.-Nr.: ???; Last edited: 23.01.2007 08:58
IC201 IC207 = LT1763IS8-5#PBF: LDO 5V/500mA, Vin 20V (-40-125°C); Manufacturer: Linear Technology; Class I: Discret; Package information: Unknown; Best.-Nr.: Farnell 229-5214; Class II: LDO 5V/500mA, Vin 20V (-40-125°C); Datasheet: ???; Package reference: SO-8
IC202 IC208 = LM57CISD-10: Temperature Sensor/Switch -40 - 150°C, Resistor-Programmable, 10°C Hysterese; Manufacturer: Texas Instruments; Class I: Sensor; Best.-Nr.: DigiKey: LM57CISD-10/NOPBCT-ND; Class II: Temperature Sensor/Switch -40 - 150°C, Resistor-Programmable, 10°C Hysterese
IC203 = AMC3301DWE: ±250 mV Input Voltage Range, Reinforced Isolated Amplifier and High Bandwidth of 300 kHz; Manufacturer: Texas Instruments; Class II: ±250 mV, 300KHz, -40-125°C; Package information: Unknown; Best.-Nr.: DigiKey: 296-AMC3301DWE-ND; Class I: Isolated Amplifier; Datasheet: Unknown; Package reference: SOIC-16-W
IC204 IC209 = ISO7742DW: Quad-CH 100Mbps Isolators 2 IN/2 OUT, 5000V Reinforced, (-40-125°C); Manufacturer: Texas Instruments; Class I: Optocoupler; Package information: Unknown; Best.-Nr.: DigiKey: 296-44609-1-ND; Class II: Quad-CH 100Mbps Isolators 2 IN/2 OUT, 5000V Reinforced, (-40-125°C); Datasheet: Unknown; Package reference: SOIC-16W
IC205 IC210 = SN74LVC2G14D_: as IC104 on sheet 1166V30-1; Datasheet: SCES200J; Class II: Dual Inverter with Schmitt Trigger Input; value111: SN74LVC2G14DBV; Last edited: 22.01.2007 11:08
IC206 IC211 = RAA2261104GNP: Low -Side GaN FET-Driver, 6,5V - 18V; Manufacturer: Renesas; Class I: Discret; Package information: Unknown; Best.-Nr.: Mouser: 968-2261104GNP#AA0; Class II: Low -Side GaN FET-Driver, 6,5V - 18V; Datasheet: Rev. Mar 2002; Package reference: QFN-16
IC212 = AMC1311BQDWVRQ1: 2V Input, Automotive High-Impedance, Reinforced Isolated Amplifier for Voltage Sensing; Manufacturer: Texas Instruments; Class II: 2V, 275KHz, -40-125°C; Package information: Unknown; Best.-Nr.: Mouser: 595-AMC1311BQDWVRQ1; Class I: Isolated Amplifier; Datasheet: Unknown; Package reference: SOIC-8-W
IC213 = ADA4940-1ARZ: Fully Differential ADC Drivers (-40-125°C); Manufacturer: ANALOG DEVICES; Class I: Analog; Best.-Nr.: Farnell 209-6178; Class II: Fully Differential ADC Drivers (-40-125°C); Datasheet: DSO11449, Ver. Aug 2000; Last edited: 04.01.2007 10:14; Package Reference: SOIC-N-8
J201 = FCR7350B Schwarz: Labor Winkelbuchsen 4mm Schwarz; Manufacturer: CLIFF Electronic; Class I: Connectors; Best.-Nr.: Farnell: 185-4507; Class II: Labor Winkelbuchsen 4mm Schwarz; Last edited: 07.03.2007 13:28
L201-L204 = CB2518T101K: 100µH, 60/120mA. (1007), -40-105°C; Manufacturer: Taiyo Yuden; Class I: Pasive; Best.-Nr.: DigiKey:   587-2192-1-ND; Class II: 100µH, 60/120mA. (1007), -40-105°C; Last edited: 08.12.2006 12:28
PS201 PS202 = R24P12S/P/X2/R6.4: DC/DC Converter 24V to 12V, 1W, 84mA (unregulated) 6,4KVDC Rainforced; Manufacturer: Recom; Class I: Analog; Package information: Unknown; Best.-Nr.: Mouser: 919-R24P12SX2PR6.4; Class II: DC/DC Converter 24V to 12V, 1W, 84mA (unregulated) 6,4KVDC Rainforced; Package reference: SIP-7; Datasheet: Rev. 28 Apr 2002
Q201 Q202 = EPC2206: GaN-Fet 80V, 2.2mOhm, 90A; Manufacturer: EPC; Class I: Discret; Package information: Unknown; Best.-Nr.: DigiKey: 917-1212-1-ND; Class II: GaN-Fet 80V, 2.2mOhm, 90A; Datasheet: Rev. Mar 2002; Package reference: DIE
R201-R215 R217 R218 R220-R230 R232-R242 = Res_SMD: Resistor SMD; Class I: Pasiv; Class II: Resistor; Last edited: 17.11.2006 11:38
  R201-R203 R207: value: 470R
  R204 R208 R222: value: 10K
  R205 R220: value: 280K
  R206 R221: value: 105K
  R209 R223: value: 3K3
  R210 R214 R215 R224 R229 R230 R241 R242: value: 0R
  R211 R225: value: 220R
  R212 R226 R232 R234 R236 R238: value: 49R9
  R213 R228: value: 5R6
  R217 R218: value: 10R
  R227 R240: value: 2K
  R233 R237: value: 1K
  R235: value: 499K/0,1%/10ppm/100V
  R239: value: 10K/0,1%/10ppm
R216 R231 = CSS2H-2512R-1L00F: Shunt 0.001R, 5W, 1%, 50ppm/°C; Manufacturer: Bourns; Class I: Pasiv; Class II: Shunt 5W; Best.-Nr.: Farnell 257-6347; Last edited: 23.11.2010 14:12; value: 0.001R
R219 = GMR320HJBFA10L0: Shunt 0.010R, 10W, 1%, 25ppm; Manufacturer: ROHM; Class I: Pasiv; Class II: Shunt 10W; Best.-Nr.: DigiKey 511-GMR320HJBFA10L0CT-ND; Mouser: 755-GMR320HJBFA10L0; Last edited: 23.11.2006 14:12; value: 0.010R

## Sheet 1166V30-3.SchDoc: Half-Bridge Phase 2
size A3; Author: M. Kutzsche; Organization: Kübrich Ing.-Gesellschaft; Address1: mbH & Co. KG; Address2: Weißmühle 10; Address3: D-96170 Priesendorf; DocumentNumber: UltraZohm; Revision: 30; SheetNumber: 3; SheetTotal: 5
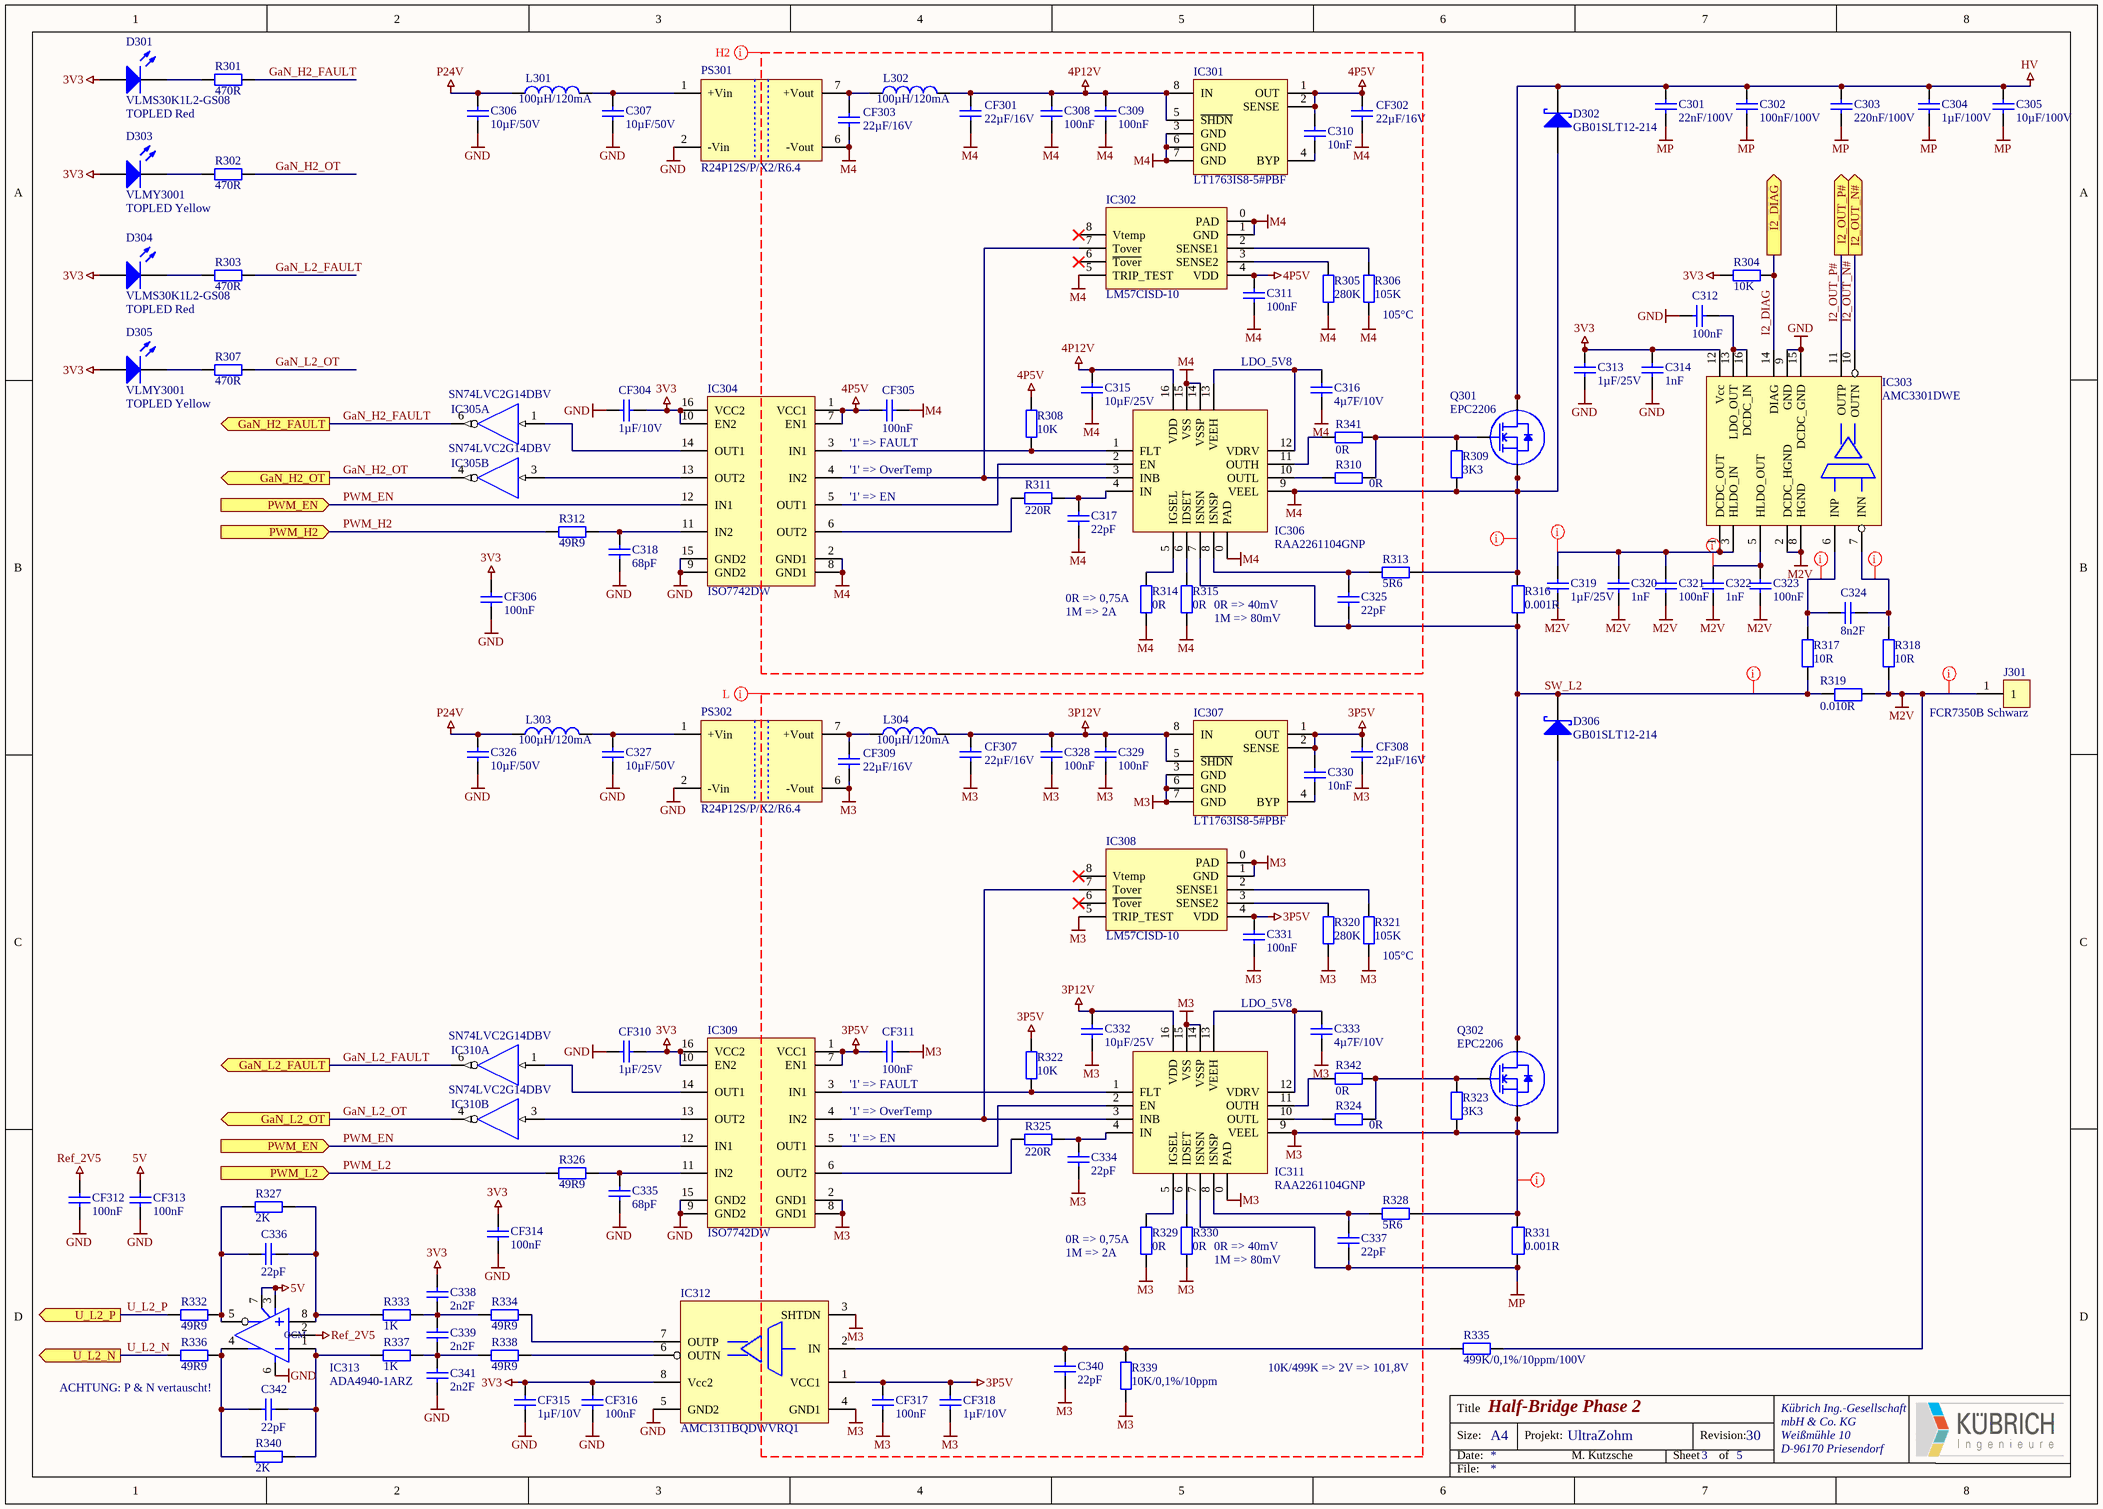
[diagram p2: 1166V30-3.SchDoc]

### Parts
C301  22nF/100V  [0805-Cap]
C302  100nF/100V  [0805-Cap]
C303  220nF/100V  [0805-Cap]
C304  1µF/100V  [0805-Cap]
C305  10µF/100V  [1210-Cap]
C306  10µF/50V  [1206-Cap]
C307  10µF/50V  [1206-Cap]
C308  100nF  [0603-Cap]
C309  100nF  [0603-Cap]
C310  10nF  [0603-Cap]
C311  100nF  [0603-Cap]
C312  100nF  [0603-Cap]
C313  1µF/25V  [1206-Cap]
C314  1nF  [1206-Cap]
C315  10µF/25V  [0805-Cap]
C316  4µ7F/10V  [0805-Cap]
C317  22pF  [0603-Cap]
C318  68pF  [0603-Cap]
C319  1µF/25V  [0603-Cap]
C320  1nF  [0603-Cap]
C321  100nF  [0603-Cap]
C322  1nF  [1206-Cap]
C323  100nF  [1206-Cap]
C324  8n2F  [0603-Cap]
C325  22pF  [0603-Cap]
C326  10µF/50V  [1206-Cap]
C327  10µF/50V  [1206-Cap]
C328  100nF  [0603-Cap]
C329  100nF  [0603-Cap]
C330  10nF  [0603-Cap]
C331  100nF  [0603-Cap]
C332  10µF/25V  [0805-Cap]
C333  4µ7F/10V  [0805-Cap]
C334  22pF  [0603-Cap]
C335  68pF  [0603-Cap]
C336  22pF  [0603-Cap]
C337  22pF  [0603-Cap]
C338  2n2F  [0603-Cap]
C339  2n2F  [0603-Cap]
C340  22pF  [0603-Cap]
C341  2n2F  [0603-Cap]
C342  22pF  [0603-Cap]
CF301  22µF/16V  [0805-Cap]
CF302  22µF/16V  [0805-Cap]
CF303  22µF/16V  [0805-Cap]
CF304  1µF/10V  [0603-Cap]
CF305  100nF  [0603-Cap]
CF306  100nF  [0603-Cap]
CF307  22µF/16V  [0805-Cap]
CF308  22µF/16V  [0805-Cap]
CF309  22µF/16V  [0805-Cap]
CF310  1µF/25V  [0603-Cap]
CF311  100nF  [0603-Cap]
CF312  100nF  [0603-Cap]
CF313  100nF  [0603-Cap]
CF314  100nF  [0603-Cap]
CF315  1µF/10V  [0603-Cap]
CF316  100nF  [0603-Cap]
CF317  100nF  [0603-Cap]
CF318  1µF/10V  [0603-Cap]
D301  VLMS30K1L2-GS08  Class II: TOPLED Red  [PLCC-2_rot]
D302  GB01SLT12-214  [DO-214 (SMB)]
D303  VLMY3001  Class II: TOPLED Yellow  [PLCC-2_gelb]
D304  VLMS30K1L2-GS08  Class II: TOPLED Red  [PLCC-2_rot]
D305  VLMY3001  Class II: TOPLED Yellow  [PLCC-2_gelb]
D306  GB01SLT12-214  [DO-214 (SMB)]
IC301  LT1763IS8-5#PBF  [SOIC-8-N]
IC302  LM57CISD-10  [WSON-8 (2.5x2.5mm)]
IC303  AMC3301DWE  [SOIC-16-W - 8.1mm]
IC304  ISO7742DW  [SOIC-16-W - 8.1mm]
IC305  SN74LVC2G14DBV  [SOT-23-6]  (parts A,B of 2)
IC306  RAA2261104GNP  [QFN-16 (4x4mm)]
IC307  LT1763IS8-5#PBF  [SOIC-8-N]
IC308  LM57CISD-10  [WSON-8 (2.5x2.5mm)]
IC309  ISO7742DW  [SOIC-16-W - 8.1mm]
IC310  SN74LVC2G14DBV  [SOT-23-6]  (parts A,B of 2)
IC311  RAA2261104GNP  [QFN-16 (4x4mm)]
IC312  AMC1311BQDWVRQ1  [SOIC-8-W]
IC313  ADA4940-1ARZ  [SOIC-8-N]
J301  FCR7350B Schwarz  [SLB4-I/90 - 4mm - Schwarz - CLIFF]
L301  100µH/120mA  [1007-IND (2518)]
L302  100µH/120mA  [1007-IND (2518)]
L303  100µH/120mA  [1007-IND (2518)]
L304  100µH/120mA  [1007-IND (2518)]
PS301  R24P12S/P/X2/R6.4  [SIP-7 Single - X2]
PS302  R24P12S/P/X2/R6.4  [SIP-7 Single - X2]
Q301  EPC2206  [D0232]
Q302  EPC2206  [D0232]
R301  470R  [0603-Res]
R302  470R  [0603-Res]
R303  470R  [0603-Res]
R304  10K  [0603-Res]
R305  280K  [0603-Res]
R306  105K  [0603-Res]
R307  470R  [0603-Res]
R308  10K  [0603-Res]
R309  3K3  [0603-Res]
R310  0R  [0603-Res]
R311  220R  [0603-Res]
R312  49R9  [0603-Res]
R313  5R6  [0603-Res]
R314  0R  [0603-Res]
R315  0R  [0603-Res]
R316  0.001R  [2512]
R317  10R  [0603-Res]
R318  10R  [0603-Res]
R319  0.010R  [GMR320]
R320  280K  [0603-Res]
R321  105K  [0603-Res]
R322  10K  [0603-Res]
R323  3K3  [0603-Res]
R324  0R  [0603-Res]
R325  220R  [0603-Res]
R326  49R9  [0603-Res]
R327  2K  [0603-Res]
R328  5R6  [0603-Res]
R329  0R  [0603-Res]
R330  0R  [0603-Res]
R331  0.001R  [2512]
R332  49R9  [0603-Res]
R333  1K  [0603-Res]
R334  49R9  [0603-Res]
R335  499K/0,1%/10ppm/100V  [0805-Res]
R336  49R9  [0603-Res]
R337  1K  [0603-Res]
R338  49R9  [0603-Res]
R339  10K/0,1%/10ppm  [0603-Res]
R340  2K  [0603-Res]
R341  0R  [0603-Res]
R342  0R  [0603-Res]

### Ports
GaN_H2_FAULT (out), GaN_H2_OT (out), GaN_L2_FAULT (out), GaN_L2_OT (out), I2_DIAG (out), I2_OUT_N# (out), I2_OUT_P# (out), PWM_EN (in), PWM_H2 (in), PWM_L2 (in), U_L2_N (out), U_L2_P (out)

### Nets
3P5V: C330.1 C331.1 CF308.1 CF311.2 CF317.1 CF318.1 IC307.1(OUT) IC307.2(SENSE) IC308.4(VDD) IC309.1(VCC1) IC309.7(EN1) IC312.1(VCC1) R322.1
3P12V: C328.1 C329.1 C332.2 CF307.1 IC307.5(~{SHDN}) IC307.8(IN) IC311.16(VDD) L304.2
3V3: C313.1 C314.1 C338.2 CF304.1 CF306.1 CF310.1 CF314.1 CF315.1 CF316.1 D301.1(A) D303.1(A) D304.1(A) D305.1(A) IC303.12(Vcc) IC304.10(EN2) IC304.16(VCC2) IC305.5(VCC) IC309.10(EN2) IC309.16(VCC2) IC310.5(VCC) IC312.8(Vcc2) R304.2  [also labelled VCC]
4P5V: C310.1 C311.1 CF302.1 CF305.2 IC301.1(OUT) IC301.2(SENSE) IC302.4(VDD) IC304.1(VCC1) IC304.7(EN1) R308.1
4P12V: C308.1 C309.1 C315.2 CF301.1 IC301.5(~{SHDN}) IC301.8(IN) IC306.16(VDD) L302.2
5V: CF313.1 IC313.3(V+) IC313.7(EN)
GND: C306.1 C307.1 C312.1 C313.2 C314.2 C318.1 C326.1 C327.1 C335.1 C341.1 CF304.2 CF306.2 CF310.2 CF312.2 CF313.2 CF314.2 CF315.2 CF316.2 IC303.9(GND) IC303.15(DCDC_GND) IC304.9(GND2) IC304.15(GND2) IC305.2(GND) IC309.9(GND2) IC309.15(GND2) IC310.2(GND) IC312.5(GND2) IC313.6(V-) PS301.2(-Vin) PS302.2(-Vin)
HV: C301.1 C302.1 C303.1 C304.1 C305.1 D302.2(K) Q301.3(D1) Q301.4(D2) Q301.7(D3) Q301.8(D4) Q301.11(D5) Q301.12(D6) Q301.15(D7) Q301.16(D8) Q301.19(D9) Q301.20(D10) Q301.23(D11) Q301.24(D12) Q301.27(D13) Q301.28(D14)
M2V: C319.2 C320.2 C321.2 C322.2 C323.2 IC303.2(DCDC_HGND) IC303.8(HGND) J301.1 R318.1 R319.1 R335.2
M3: C328.2 C329.2 C331.2 C332.1 C333.2 C334.1 C340.1 CF307.2 CF308.2 CF309.2 CF311.1 CF317.2 CF318.2 D306.1(A) IC307.3(GND) IC307.6(GND) IC307.7(GND) IC308.0(PAD) IC308.1(GND) IC308.5(TRIP_TEST) IC309.2(GND1) IC309.8(GND1) IC311.0(PAD) IC311.9(VEEL) IC311.14(VSSP) IC311.15(VSS) IC312.3(SHTDN) IC312.4(GND1) PS302.6(-Vout) Q302.2(S1) Q302.5(S2) Q302.6(S3) Q302.9(S4) Q302.10(S5) Q302.13(S6) Q302.14(S7) Q302.17(S8) Q302.18(S9) Q302.21(S10) Q302.22(S11) Q302.25(S12) Q302.26(S13) Q302.29(S14) Q302.30(Sub) R320.2 R321.2 R323.1 R328.2 R329.2 R330.2 R331.2 R339.2
M4: C308.2 C309.2 C311.2 C315.1 C316.2 C317.1 CF301.2 CF302.2 CF303.2 CF305.1 D302.1(A) IC301.3(GND) IC301.6(GND) IC301.7(GND) IC302.0(PAD) IC302.1(GND) IC302.5(TRIP_TEST) IC304.2(GND1) IC304.8(GND1) IC306.0(PAD) IC306.9(VEEL) IC306.14(VSSP) IC306.15(VSS) PS301.6(-Vout) Q301.2(S1) Q301.5(S2) Q301.6(S3) Q301.9(S4) Q301.10(S5) Q301.13(S6) Q301.14(S7) Q301.17(S8) Q301.18(S9) Q301.21(S10) Q301.22(S11) Q301.25(S12) Q301.26(S13) Q301.29(S14) Q301.30(Sub) R305.2 R306.2 R309.1 R313.2 R314.2 R315.2 R316.2
MP: C301.2 C302.2 C303.2 C304.2 C305.2 C337.1 IC311.7(ISNSN) R331.1
P24V: C306.2 C326.2 L301.1 L303.1
Ref_2V5: CF312.1 IC313.2(OCM)
GaN_H2_FAULT: IC305.6(1Y) R301.2 ; port GaN_H2_FAULT
GaN_H2_OT: IC305.4(2Y) R302.2 ; port GaN_H2_OT
GaN_L2_FAULT: IC310.6(1Y) R303.2 ; port GaN_L2_FAULT
GaN_L2_OT: IC310.4(2Y) R307.2 ; port GaN_L2_OT
I2_DIAG: IC303.14(DIAG) R304.1 ; port I2_DIAG
I2_OUT_N#: IC303.10(OUTN) ; port I2_OUT_N#
I2_OUT_P#: IC303.11(OUTP) ; port I2_OUT_P#
PWM_EN: IC304.12(IN1) IC309.12(IN1) ; port PWM_EN
PWM_H2: R312.2 ; port PWM_H2
PWM_L2: R326.2 ; port PWM_L2
SW_L2: C325.1 D306.2(K) IC306.7(ISNSN) Q302.3(D1) Q302.4(D2) Q302.7(D3) Q302.8(D4) Q302.11(D5) Q302.12(D6) Q302.15(D7) Q302.16(D8) Q302.19(D9) Q302.20(D10) Q302.23(D11) Q302.24(D12) Q302.27(D13) Q302.28(D14) R316.1 R317.1 R319.2
U_L2_N: R336.2 ; port U_L2_N
U_L2_P: R332.2 ; port U_L2_P
NetC307_2: C307.2 L301.2 PS301.1(+Vin)
NetC310_2: C310.2 IC301.4(BYP)
NetC312_2: C312.2 IC303.13(LDO_OUT) IC303.16(DCDC_IN)
NetC316_1: C316.1 IC306.12(VDRV) IC306.13(VEEH)
NetC317_2: C317.2 IC306.4(IN) R311.1
NetC318_2: C318.2 IC304.11(IN2) R312.1
NetC319_1: C319.1 C320.1 C321.1 IC303.1(DCDC_OUT) IC303.3(HLDO_IN)
NetC322_1: C322.1 C323.1 IC303.5(HLDO_OUT)
NetC324_1: C324.1 IC303.7(INN) R318.2
NetC324_2: C324.2 IC303.6(INP) R317.2
NetC325_2: C325.2 IC306.8(ISNSP) R313.1
NetC327_2: C327.2 L303.2 PS302.1(+Vin)
NetC330_2: C330.2 IC307.4(BYP)
NetC333_1: C333.1 IC311.12(VDRV) IC311.13(VEEH)
NetC334_2: C334.2 IC311.4(IN) R325.1
NetC335_2: C335.2 IC309.11(IN2) R326.1
NetC336_1: C336.1 IC313.8(+) R327.1 R333.2
NetC336_2: C336.2 IC313.5(Out) R327.2 R332.1
NetC337_2: C337.2 IC311.8(ISNSP) R328.1
NetC338_1: C338.1 C339.2 R333.1 R334.2
NetC339_1: C339.1 C341.2 R337.1 R338.2
NetC340_2: C340.2 IC312.2(IN) R335.1 R339.1
NetC342_1: C342.1 IC313.1(-) R337.2 R340.1
NetC342_2: C342.2 IC313.4(Out) R336.1 R340.2
NetCF303_1: CF303.1 L302.1 PS301.7(+Vout)
NetCF309_1: CF309.1 L304.1 PS302.7(+Vout)
NetD301_2: D301.2(K) R301.1
NetD303_2: D303.2(K) R302.1
NetD304_2: D304.2(K) R303.1
NetD305_2: D305.2(K) R307.1
NetIC302_2: IC302.2(SENSE1) R306.1
NetIC302_3: IC302.3(SENSE2) R305.1
NetIC302_7: IC302.7(Tover) IC304.4(IN2) IC306.3(INB)
NetIC304_3: IC304.3(IN1) IC306.1(FLT) R308.2
NetIC304_5: IC304.5(OUT1) IC306.2(EN)
NetIC304_6: IC304.6(OUT2) R311.2
NetIC304_13: IC304.13(OUT2) IC305.3(2A)
NetIC304_14: IC304.14(OUT1) IC305.1(1A)
NetIC306_5: IC306.5(IGSEL) R314.1
NetIC306_6: IC306.6(IDSET) R315.1
NetIC306_10: IC306.10(OUTL) R310.1
NetIC306_11: IC306.11(OUTH) R341.1
NetIC308_2: IC308.2(SENSE1) R321.1
NetIC308_3: IC308.3(SENSE2) R320.1
NetIC308_7: IC308.7(Tover) IC309.4(IN2) IC311.3(INB)
NetIC309_3: IC309.3(IN1) IC311.1(FLT) R322.2
NetIC309_5: IC309.5(OUT1) IC311.2(EN)
NetIC309_6: IC309.6(OUT2) R325.2
NetIC309_13: IC309.13(OUT2) IC310.3(2A)
NetIC309_14: IC309.14(OUT1) IC310.1(1A)
NetIC311_5: IC311.5(IGSEL) R329.1
NetIC311_6: IC311.6(IDSET) R330.1
NetIC311_10: IC311.10(OUTL) R324.1
NetIC311_11: IC311.11(OUTH) R342.1
NetIC312_6: IC312.6(OUTN) R338.1
NetIC312_7: IC312.7(OUTP) R334.1
NetQ301_1: Q301.1(G) R309.2 R310.2 R341.2
NetQ302_1: Q302.1(G) R323.2 R324.2 R342.2

Not connected (* = marked no-connect by the designer): IC302 6(~{Tover})* 8(Vtemp)*; IC308 6(~{Tover})* 8(Vtemp)*

### Layout directives
net class H2: 4P5V, 4P12V, M2V, M4, NetC319_1, NetC322_1, NetC324_1, NetC324_2, SW_L2
net class L: 3P5V, 3P12V, M3

### Notes on the sheet
- (near R306) 105°C
- LDO_5V8
- '1' => FAULT
- '1' => OverTemp
- (near IC304) '1' => EN
- (near R314) 1M => 2A
- (near R314) 0R => 0,75A
- (near R315) 0R => 40mV
- (near R315) 1M => 80mV
- (near R321) 105°C
- (near IC309) '1' => EN
- (near R329) 1M => 2A
- (near R329) 0R => 0,75A
- (near R330) 0R => 40mV
- (near R330) 1M => 80mV
- ACHTUNG: P & N vertauscht!
- (near R335) 10K/499K => 2V => 101,8V
- Title
- Size:
- Date:
- A4
- Projekt:
- Sheet
- Revision:
- of
- File:

### Library data of the parts
C301-C342 CF301-CF318 = Cap_SMD: Capacitor (SMD); Class I: Pasiv; Class II: Capacitor; Last edited: 20.11.2006 10:25
  C301: value: 22nF/100V
  C302: value: 100nF/100V
  C303: value: 220nF/100V
  C304: value: 1µF/100V
  C305: value: 10µF/100V
  C306 C307 C326 C327: value: 10µF/50V
  C308 C309 C311 C312 C321 C323 C328 C329 C331 CF305 CF306 CF311-CF314 CF316 CF317: value: 100nF
  C310 C330: value: 10nF
  C313 C319 CF310: value: 1µF/25V
  C314 C320 C322: value: 1nF
  C315 C332: value: 10µF/25V
  C316 C333: value: 4µ7F/10V
  C317 C325 C334 C336 C337 C340 C342: value: 22pF
  C318 C335: value: 68pF
  C324: value: 8n2F
  C338 C339 C341: value: 2n2F
  CF301-CF303 CF307-CF309: value: 22µF/16V
  CF304 CF315 CF318: value: 1µF/10V
D301 D304 = VLMS30K1L2-GS08: as D201 on sheet 1166V30-2; Last edited: 23.01.2007 08:58
D302 D306 = GB01SLT12-214: as D202 on sheet 1166V30-2; Class II: Silicon Carbide Schottky Diode Vr=1200V If=1A; Datasheet: Ver. 7 Nov 2000; Package reference: DO-214AA (SMB)
D303 D305 = VLMY3001: as D203 on sheet 1166V30-2; Last edited: 23.01.2007 08:58
IC301 IC307 = LT1763IS8-5#PBF: as IC201 on sheet 1166V30-2; Class II: LDO 5V/500mA, Vin 20V (-40-125°C); Datasheet: ???; Package reference: SO-8
IC302 IC308 = LM57CISD-10: as IC202 on sheet 1166V30-2; Class II: Temperature Sensor/Switch -40 - 150°C, Resistor-Programmable, 10°C Hysterese
IC303 = AMC3301DWE: as IC203 on sheet 1166V30-2; Class I: Isolated Amplifier; Datasheet: Unknown; Package reference: SOIC-16-W
IC304 IC309 = ISO7742DW: as IC204 on sheet 1166V30-2; Class II: Quad-CH 100Mbps Isolators 2 IN/2 OUT, 5000V Reinforced, (-40-125°C); Datasheet: Unknown; Package reference: SOIC-16W
IC305 IC310 = SN74LVC2G14D_: as IC104 on sheet 1166V30-1; Datasheet: SCES200J; Class II: Dual Inverter with Schmitt Trigger Input; value111: SN74LVC2G14DBV; Last edited: 22.01.2007 11:08
IC306 IC311 = RAA2261104GNP: as IC206 on sheet 1166V30-2; Class II: Low -Side GaN FET-Driver, 6,5V - 18V; Datasheet: Rev. Mar 2002; Package reference: QFN-16
IC312 = AMC1311BQDWVRQ1: as IC212 on sheet 1166V30-2; Class I: Isolated Amplifier; Datasheet: Unknown; Package reference: SOIC-8-W
IC313 = ADA4940-1ARZ: as IC213 on sheet 1166V30-2; Class II: Fully Differential ADC Drivers (-40-125°C); Datasheet: DSO11449, Ver. Aug 2000; Last edited: 04.01.2007 10:14; Package Reference: SOIC-N-8
J301 = FCR7350B Schwarz: as J201 on sheet 1166V30-2; Class II: Labor Winkelbuchsen 4mm Schwarz; Last edited: 07.03.2007 13:28
L301-L304 = CB2518T101K: as L201 on sheet 1166V30-2; Class II: 100µH, 60/120mA. (1007), -40-105°C; Last edited: 08.12.2006 12:28
PS301 PS302 = R24P12S/P/X2/R6.4: as PS201 on sheet 1166V30-2; Class II: DC/DC Converter 24V to 12V, 1W, 84mA (unregulated) 6,4KVDC Rainforced; Package reference: SIP-7; Datasheet: Rev. 28 Apr 2002
Q301 Q302 = EPC2206: as Q201 on sheet 1166V30-2; Class II: GaN-Fet 80V, 2.2mOhm, 90A; Datasheet: Rev. Mar 2002; Package reference: DIE
R301-R315 R317 R318 R320-R330 R332-R342 = Res_SMD: Resistor SMD; Class I: Pasiv; Class II: Resistor; Last edited: 17.11.2006 11:38
  R301-R303 R307: value: 470R
  R304 R308 R322: value: 10K
  R305 R320: value: 280K
  R306 R321: value: 105K
  R309 R323: value: 3K3
  R310 R314 R315 R324 R329 R330 R341 R342: value: 0R
  R311 R325: value: 220R
  R312 R326 R332 R334 R336 R338: value: 49R9
  R313 R328: value: 5R6
  R317 R318: value: 10R
  R327 R340: value: 2K
  R333 R337: value: 1K
  R335: value: 499K/0,1%/10ppm/100V
  R339: value: 10K/0,1%/10ppm
R316 R331 = CSS2H-2512R-1L00F: as R216 on sheet 1166V30-2; Last edited: 23.11.2010 14:12; value: 0.001R
R319 = GMR320HJBFA10L0: as R219 on sheet 1166V30-2; Last edited: 23.11.2006 14:12; value: 0.010R